# EasyEDA schematic Dispositivo H2O Esquemático#.json
TITLE: Dispositivo H2O; REV: 1.0; Date: 2020-11-25; Sheet: 1/1; Drawn By: J. Williams Escobar; Company: ITE
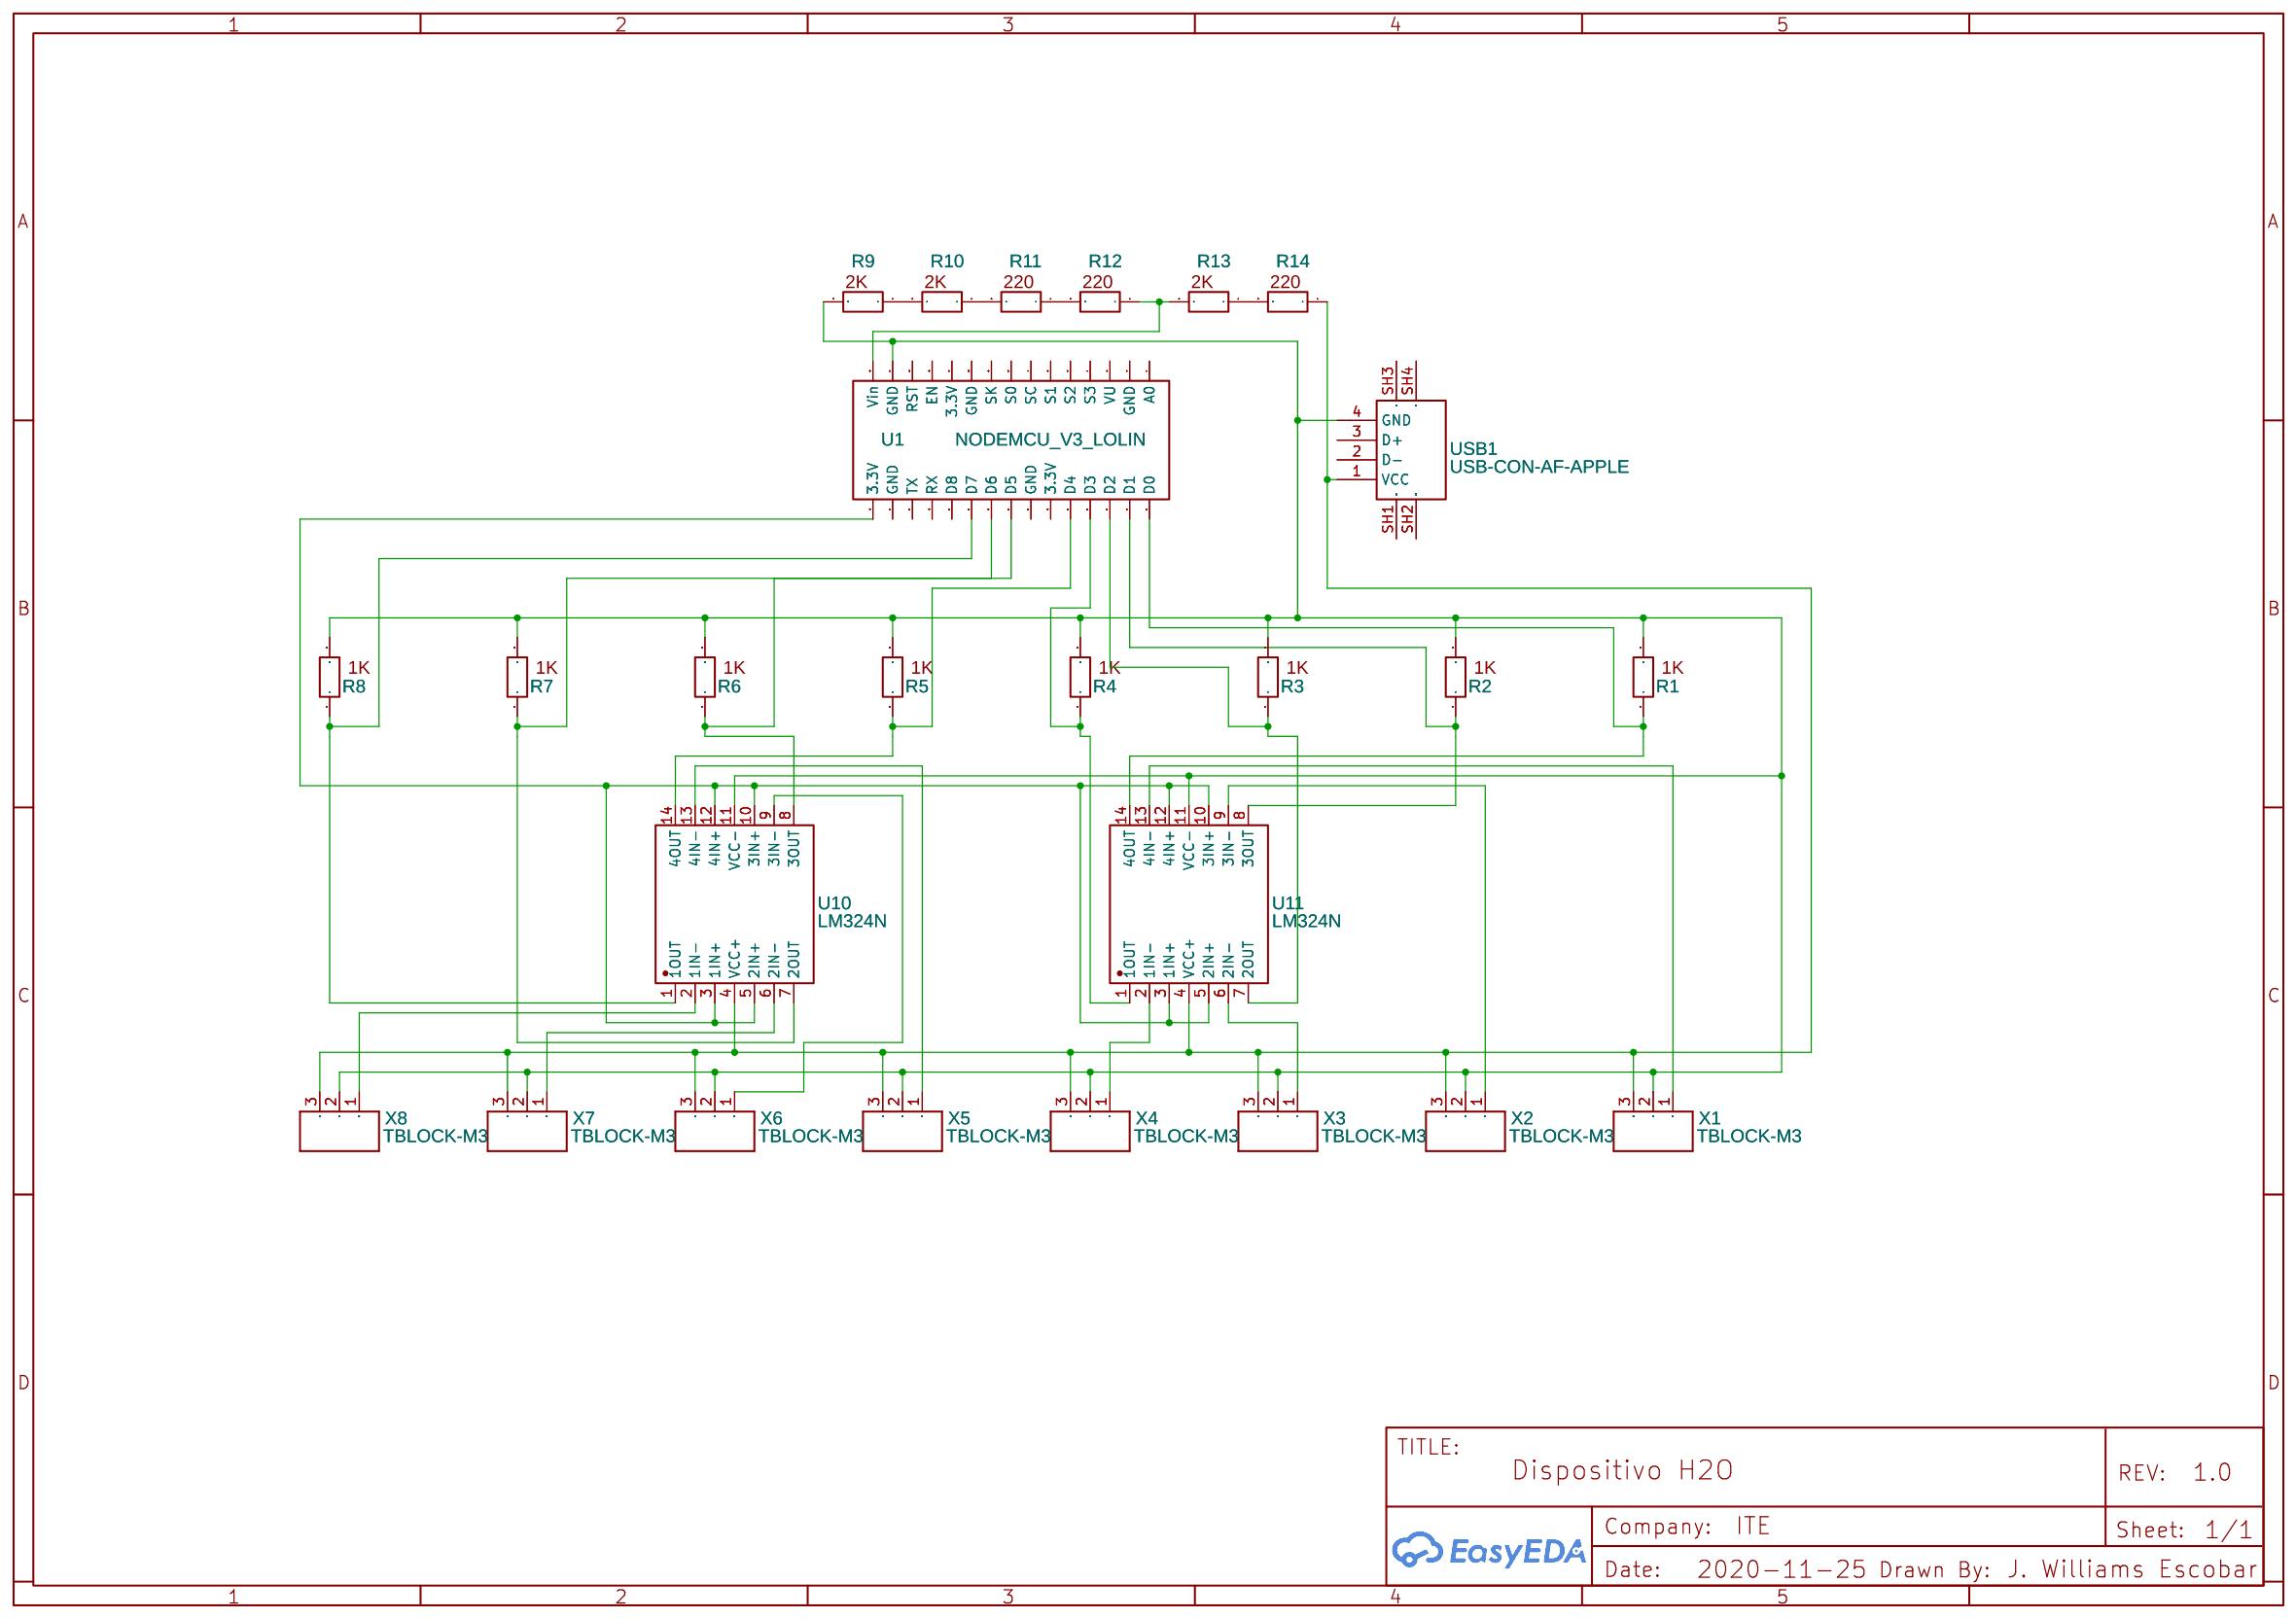
[diagram p0: schematic sheet]

## Parts
R1  R9  [RESISTOR 1K]
R2  R9  [RESISTOR 1K]
R3  R9  [RESISTOR 1K]
R4  R9  [RESISTOR 1K]
R5  R9  [RESISTOR 1K]
R6  R9  [RESISTOR 1K]
R7  R9  [RESISTOR 1K]
R8  R9  [RESISTOR 1K]
R9  R9  [RESISTOR 1K]
R10  R16  [RESISTOR 1K]
R11  R17  [RESISTOR 1K]
R12  R9  [RESISTOR 1K]
R13  R9  [RESISTOR 1K]
R14  R9  [RESISTOR 1K]
U1  NODEMCU_V3_LOLIN  [NODEMCU V3 LOLIN]
U10  LM324N  [DIP-14_L19.0-W7.0-P2.54-LS7.6-BL]
U11  LM324N  [DIP-14_L19.0-W7.0-P2.54-LS7.6-BL]
USB1  USB-CON-AF-APPLE  [USB-A-SMD_AF-APPLE-10.6]
X1  TBLOCK-M3  [TBLOCK-M3]
X2  TBLOCK-M3  [TBLOCK-M3]
X3  TBLOCK-M3  [TBLOCK-M3]
X4  TBLOCK-M3  [TBLOCK-M3]
X5  TBLOCK-M3  [TBLOCK-M3]
X6  TBLOCK-M3  [TBLOCK-M3]
X7  TBLOCK-M3  [TBLOCK-M3]
X8  TBLOCK-M3  [TBLOCK-M3]

## Library data of the parts
R1-R14 = Resistencia 1K: Contributor: luisavileshernandez
U1 = NODEMCU_V3_LOLIN: Manufacturer Part: NodeMcu V3 LoLin; Contributor: Priyanshu Kumar
U10 U11 = LM324N: Supplier: LCSC; Manufacturer: TI; Contributor: LCSC; Supplier Part: C114380
USB1 = USB-CON-AF-APPLE: Supplier: LCSC; Manufacturer: ValuePro; image: //image.lceda.cn/szlcsc/C42567.jpg; Supplier Part: C42567
X1-X8 = TBLOCK-M3: Contributor: amit_9in87

## Nets
Net-(R1-1): R1.1 U1.30(D0) U11.14(4OUT)
Net-(R1-2): R1.2 R2.2 R3.2 R4.2 R5.2 R6.2 R7.2 R8.2 R9.2 U1.14(GND) U10.11(VCC-) U11.11(VCC-) USB1.4(GND) X1.2(P$2) X2.2(P$2) X3.2(P$2) X4.2(P$2) X5.2(P$2) X6.2(P$2) X7.2(P$2) X8.2(P$2)
Net-(R2-1): R2.1 U1.29(D1) U11.8(3OUT)
Net-(R3-1): R3.1 U1.28(D2) U11.7(2OUT)
Net-(R4-1): R4.1 U1.27(D3) U11.1(1OUT)
Net-(R5-1): R5.1 U1.26(D4) U10.14(4OUT)
Net-(R6-1): R6.1 U1.23(D5) U10.8(3OUT)
Net-(R7-1): R7.1 U1.22(D6) U10.7(2OUT)
Net-(R8-1): R8.1 U1.21(D7) U10.1(1OUT)
Net-(R9-1): R9.1 R10.2
Net-(R10-1): R10.1 R11.2
Net-(R11-1): R11.1 R12.2
Net-(R12-1): R12.1 R13.2 U1.15(Vin)
Net-(R13-1): R13.1 R14.2
Net-(R14-1): R14.1 U10.4(VCC+) U11.4(VCC+) USB1.1(VCC) X1.3(P$3) X2.3(P$3) X3.3(P$3) X4.3(P$3) X5.3(P$3) X6.3(P$3) X7.3(P$3) X8.3(P$3)
Net-(U1-16): U1.16(3.3V) U10.3(1IN+) U10.5(2IN+) U10.10(3IN+) U10.12(4IN+) U11.3(1IN+) U11.5(2IN+) U11.10(3IN+) U11.12(4IN+)
Net-(U10-2): U10.2(1IN-) X8.1(P$1)
Net-(U10-6): U10.6(2IN-) X7.1(P$1)
Net-(U10-9): U10.9(3IN-) X6.1(P$1)
Net-(U10-13): U10.13(4IN-) X5.1(P$1)
Net-(U11-2): U11.2(1IN-) X4.1(P$1)
Net-(U11-6): U11.6(2IN-) X3.1(P$1)
Net-(U11-9): U11.9(3IN-) X2.1(P$1)
Net-(U11-13): U11.13(4IN-) X1.1(P$1)

Not connected (* = marked no-connect by the designer): U1 1(A0) 2(GND) 3(VU) 4(S3) 5(S2) 6(S1) 7(SC) 8(S0) 9(SK) 10(GND) 11(3.3V) 12(EN) 13(RST) 17(GND) 18(TX) 19(RX) 20(D8) 24(GND) 25(3.3V); USB1 2(D-) 3(D+) SH1 SH2 SH3 SH4
